# EAGLE board homeboard20 (EAGLE 6.0)
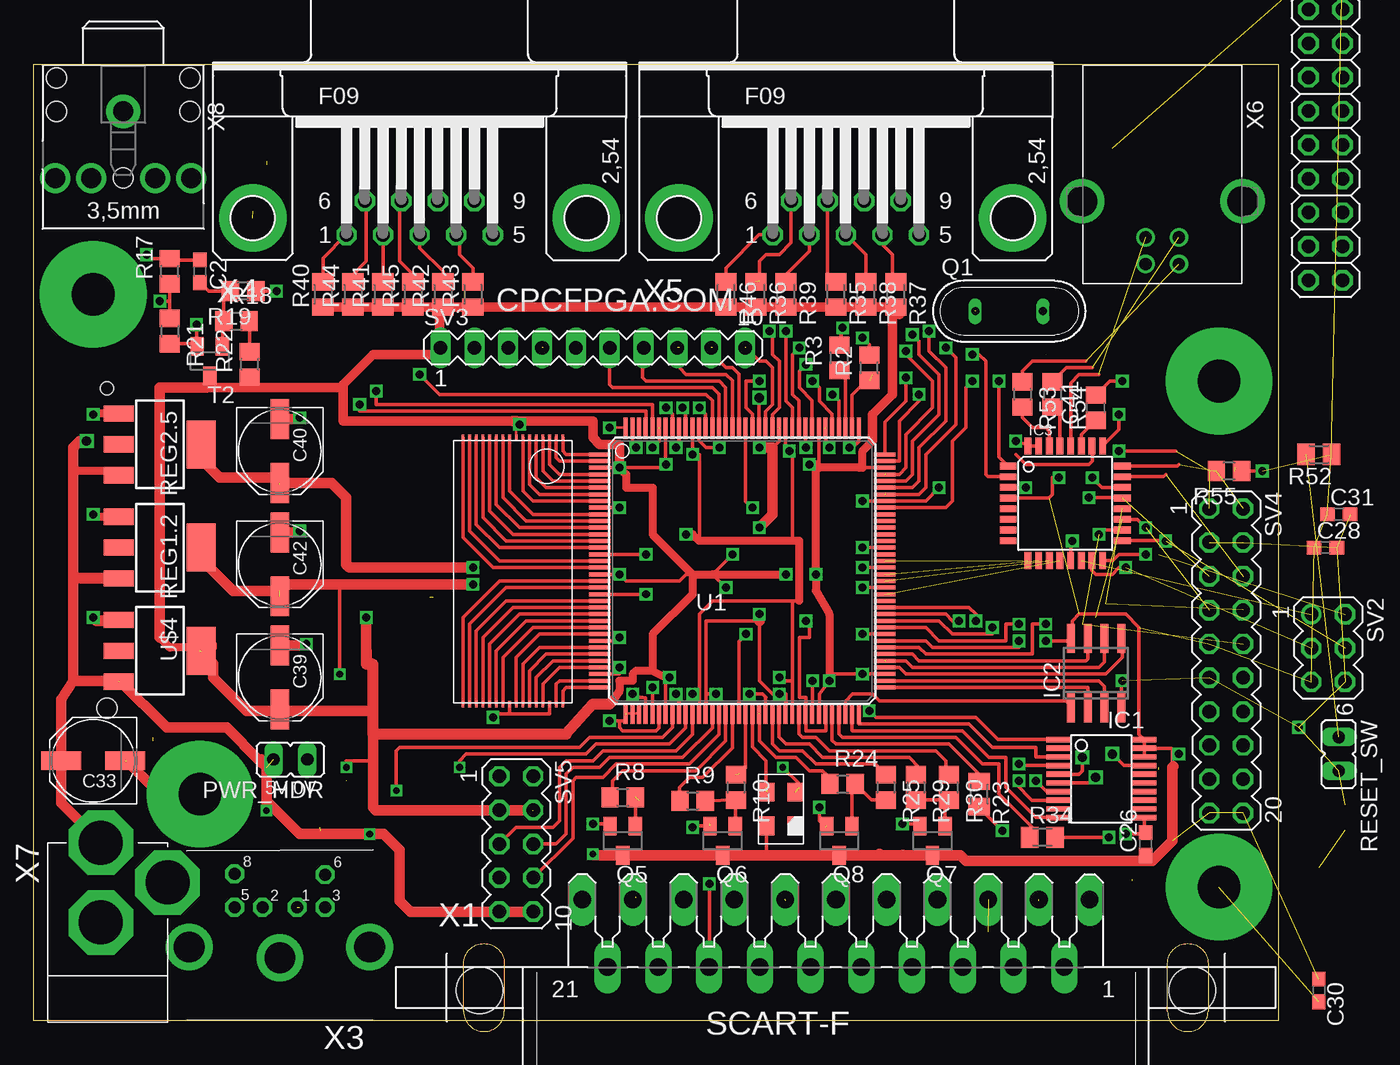
[diagram p3: board, top side]
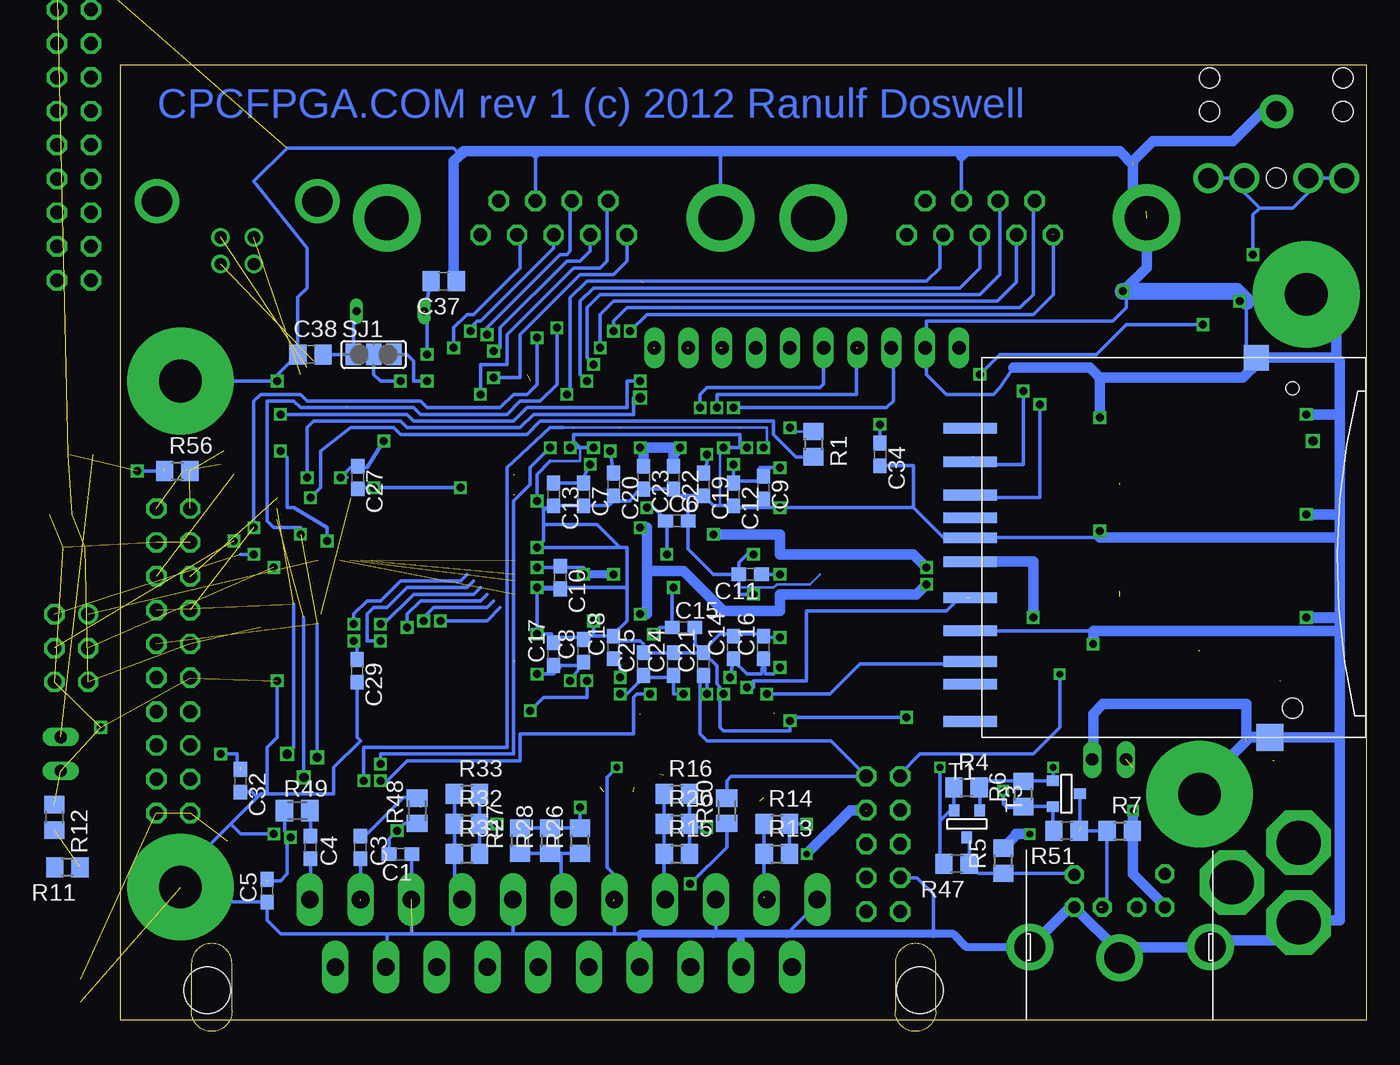
[diagram p4: board, bottom side, seen from below]

Size 93.5 x 71.75 mm. Coordinates in mm from the lower left corner, seen from the top.
Outline: 0,0 93.5,0 93.5,71.75 0,71.75 0,0
Copper layers (1*16): Top 0.0356mm / dielectric 1.5011mm / Bottom 0.0356mm
Design rules: minimum track width 6mil, minimum drill 13mil, track to track 6mil, track to pad 6mil, pad to pad 6mil, via to via 6mil, smd to smd 6mil, copper to edge 15mil, drill to drill 6mil, minimum pad ring 7mil, minimum via ring 7mil, stop-mask expansion 4mil, vias tented up to drill 0mil, thermal gap 10mil
Net classes: 1 power: width 0.6 mm, drill 1.1 mm, clearance 0.4 mm; 2 gnd: width 0.305 mm, drill 0.508 mm, clearance 0.152 mm

## Footprints (pad centres in the part's own frame; a part is rotated, then mirrored left to right if it is on the bottom)
C0603 = smd 1.1 x 1: 1 -0.85,0; 2 0.85,0
PANASONIC_D = smd 3 x 1.4: + 2.4,0; - -2.4,0
C0805 = smd 1.3 x 1.5: 1 -0.95,0; 2 0.95,0
VO20 = smd 0.4 x 1.8: 1 5.85,6.15; 2 5.2,6.15; 3 4.55,6.15; 4 3.9,6.15; 5 3.25,6.15; 6 2.6,6.15; 7 1.95,6.15; 8 1.3,6.15; 9 0.65,6.15; 10 0,6.15; 11 0,-0.3; 12 0.65,-0.3; 13 1.3,-0.3; 14 1.95,-0.3; 15 2.6,-0.3; 16 3.25,-0.3; 17 3.9,-0.3; 18 4.55,-0.3; 19 5.2,-0.3; 20 5.85,-0.3
SO-08 = smd 0.6 x 2.2: 1 -1.905,-2.6; 2 -0.635,-2.6; 3 0.635,-2.6; 4 1.905,-2.6; 5 1.905,2.6; 6 0.635,2.6; 7 -0.635,2.6; 8 -1.905,2.6
TQFP32-08 = smd 1.27 x 0.508: 1 -4.293,2.8; 2 -4.293,2; 3 -4.293,1.2; 4 -4.293,0.4; 5 -4.293,-0.4; 6 -4.293,-1.2; 7 -4.293,-2; 8 -4.293,-2.8; 17 4.293,-2.8; 18 4.293,-2; 19 4.293,-1.2; 20 4.293,-0.4; 21 4.293,0.4; 22 4.293,1.2; 23 4.293,2; 24 4.293,2.8 | smd 0.508 x 1.27: 9 -2.8,-4.293; 10 -2,-4.293; 11 -1.2,-4.293; 12 -0.4,-4.293; 13 0.4,-4.293; 14 1.2,-4.293; 15 2,-4.293; 16 2.8,-4.293; 25 2.8,4.293; 26 2,4.293; 27 1.2,4.293; 28 0.4,4.293; 29 -0.4,4.293; 30 -1.2,4.293; 31 -2,4.293; 32 -2.8,4.293
2X10 = drill 1.016 octagon: 1 -11.43,-1.27; 2 -11.43,1.27; 3 -8.89,-1.27; 4 -8.89,1.27; 5 -6.35,-1.27; 6 -6.35,1.27; 7 -3.81,-1.27; 8 -3.81,1.27; 9 -1.27,-1.27; 10 -1.27,1.27; 11 1.27,-1.27; 12 1.27,1.27; 13 3.81,-1.27; 14 3.81,1.27; 15 6.35,-1.27; 16 6.35,1.27; 17 8.89,-1.27; 18 8.89,1.27; 19 11.43,-1.27; 20 11.43,1.27
JP1 = drill 0.914 long: 1 0,-1.27; 2 0,1.27
QS = drill 0.61 long: 1 -2.54,0; 2 2.54,0
SOT23 = smd 1 x 1.4: 1 -0.95,-1.1; 2 0.95,-1.1; 3 0,1.1
R0805 = smd 1.3 x 1.5: 1 -0.95,0; 2 0.95,0
M0805 = smd 1.3 x 1.6: 1 -0.95,0; 2 0.95,0
SOT223 = smd 1.219 x 2.235: 1 -2.311,-3.099; 2 0,-3.099; 3 2.311,-3.099 | smd 3.6 x 2.2: 4 0,3.099
SJ_2 = smd 1.168 x 1.6: 1 -1.524,0; 2 0,0; 3 1.524,0
MA03-2 = drill 1.016: 1 -2.54,-1.27 | drill 1.016 octagon: 2 -2.54,1.27; 3 0,-1.27; 4 0,1.27; 5 2.54,-1.27; 6 2.54,1.27
MA10-1 = drill 1.016 long: 1 -11.43,0; 2 -8.89,0; 3 -6.35,0; 4 -3.81,0; 5 -1.27,0; 6 1.27,0; 7 3.81,0; 8 6.35,0; 9 8.89,0; 10 11.43,0
MA10-2 = drill 1.016 octagon: 1 -11.43,-1.27; 2 -11.43,1.27; 3 -8.89,-1.27; 4 -8.89,1.27; 5 -6.35,-1.27; 6 -6.35,1.27; 7 -3.81,-1.27; 8 -3.81,1.27; 9 -1.27,-1.27; 10 -1.27,1.27; 11 1.27,-1.27; 12 1.27,1.27; 13 3.81,-1.27; 14 3.81,1.27; 15 6.35,-1.27; 16 6.35,1.27; 17 8.89,-1.27; 18 8.89,1.27; 19 11.43,-1.27; 20 11.43,1.27
MA05-2 = drill 1.016 octagon: 1 -5.08,-1.27; 2 -5.08,1.27; 3 -2.54,-1.27; 4 -2.54,1.27; 5 0,-1.27; 6 0,1.27; 7 2.54,-1.27; 8 2.54,1.27; 9 5.08,-1.27; 10 5.08,1.27
SOT-23 = smd 0.787 x 0.889: 1 0.025,-1.016; 2 -0.94,1.016; 3 0.991,1.016
TQ144 = smd 1.6 x 0.3: P1 -10.7,8.75; P2 -10.7,8.25; P3 -10.7,7.75; P4 -10.7,7.25; P5 -10.7,6.75; P6 -10.7,6.25; P7 -10.7,5.75; P8 -10.7,5.25; P9 -10.7,4.75; P10 -10.7,4.25; P11 -10.7,3.75; P12 -10.7,3.25; P13 -10.7,2.75; P14 -10.7,2.25; P15 -10.7,1.75; P16 -10.7,1.25; P17 -10.7,0.75; P18 -10.7,0.25; P19 -10.7,-0.25; P20 -10.7,-0.75; P21 -10.7,-1.25; P22 -10.7,-1.75; P23 -10.7,-2.25; P24 -10.7,-2.75; P25 -10.7,-3.25; P26 -10.7,-3.75; P27 -10.7,-4.25; P28 -10.7,-4.75; P29 -10.7,-5.25; P30 -10.7,-5.75; P31 -10.7,-6.25; P32 -10.7,-6.75; P33 -10.7,-7.25; P34 -10.7,-7.75; P35 -10.7,-8.25; P36 -10.7,-8.75; P73 10.7,-8.75; P74 10.7,-8.25; P75 10.7,-7.75; P76 10.7,-7.25; P77 10.7,-6.75; P78 10.7,-6.25; P79 10.7,-5.75; P80 10.7,-5.25; P81 10.7,-4.75; P82 10.7,-4.25; P83 10.7,-3.75; P84 10.7,-3.25; P85 10.7,-2.75; P86 10.7,-2.25; P87 10.7,-1.75; P88 10.7,-1.25; P89 10.7,-0.75; P90 10.7,-0.25; P91 10.7,0.25; P92 10.7,0.75; P93 10.7,1.25; P94 10.7,1.75; P95 10.7,2.25; P96 10.7,2.75; P97 10.7,3.25; P98 10.7,3.75; P99 10.7,4.25; P100 10.7,4.75; P101 10.7,5.25; P102 10.7,5.75; P103 10.7,6.25; P104 10.7,6.75; P105 10.7,7.25; P106 10.7,7.75; P107 10.7,8.25; P108 10.7,8.75 | smd 0.3 x 1.6: P37 -8.75,-10.7; P38 -8.25,-10.7; P39 -7.75,-10.7; P40 -7.25,-10.7; P41 -6.75,-10.7; P42 -6.25,-10.7; P43 -5.75,-10.7; P44 -5.25,-10.7; P45 -4.75,-10.7; P46 -4.25,-10.7; P47 -3.75,-10.7; P48 -3.25,-10.7; P49 -2.75,-10.7; P50 -2.25,-10.7; P51 -1.75,-10.7; P52 -1.25,-10.7; P53 -0.75,-10.7; P54 -0.25,-10.7; P55 0.25,-10.7; P56 0.75,-10.7; P57 1.25,-10.7; P58 1.75,-10.7; P59 2.25,-10.7; P60 2.75,-10.7; P61 3.25,-10.7; P62 3.75,-10.7; P63 4.25,-10.7; P64 4.75,-10.7; P65 5.25,-10.7; P66 5.75,-10.7; P67 6.25,-10.7; P68 6.75,-10.7; P69 7.25,-10.7; P70 7.75,-10.7; P71 8.25,-10.7; P72 8.75,-10.7; P109 8.75,10.7; P110 8.25,10.7; P111 7.75,10.7; P112 7.25,10.7; P113 6.75,10.7; P114 6.25,10.7; P115 5.75,10.7; P116 5.25,10.7; P117 4.75,10.7; P118 4.25,10.7; P119 3.75,10.7; P120 3.25,10.7; P121 2.75,10.7; P122 2.25,10.7; P123 1.75,10.7; P124 1.25,10.7; P125 0.75,10.7; P126 0.25,10.7; P127 -0.25,10.7; P128 -0.75,10.7; P129 -1.25,10.7; P130 -1.75,10.7; P131 -2.25,10.7; P132 -2.75,10.7; P133 -3.25,10.7; P134 -3.75,10.7; P135 -4.25,10.7; P136 -4.75,10.7; P137 -5.25,10.7; P138 -5.75,10.7; P139 -6.25,10.7; P140 -6.75,10.7; P141 -7.25,10.7; P142 -7.75,10.7; P143 -8.25,10.7; P144 -8.75,10.7
GNDHOLE = drill 3.2 pad 8: GND 0,0
OSC_7C = smd 1.4 x 1.2: ENA -1.27,-1.1; GND 1.27,-1.1; OUT 1.27,1.1; VDD -1.27,1.1
SDCARD-NOHOLE = smd 0.8 x 4 bottom: 1 7.8,0.99; 2 10.3,0.99; 3 13.5,0.99; 4 15.3,0.99; 5 18,0.99; 6 20.5,0.99; 7 22.8,0.99; 8 24.5,0.99; 9 5.3,0.99; CD 12,0.99; WP 27.3,0.99 | smd 2.032 x 2.032 bottom: MT1 28.5,-21.5 | smd 1.9 x 1.9 bottom: MT3 0,-20.5 | hole 1.5: 26.3,-23.21 | hole 1: 2.3,-23.21
TSOP32 = smd 0.5 x 0.2: P1 -9.75,3.75; P2 -9.75,3.25; P3 -9.75,2.75; P4 -9.75,2.25; P5 -9.75,1.75; P6 -9.75,1.25; P7 -9.75,0.75; P8 -9.75,0.25; P9 -9.75,-0.25; P10 -9.75,-0.75; P11 -9.75,-1.25; P12 -9.75,-1.75; P13 -9.75,-2.25; P14 -9.75,-2.75; P15 -9.75,-3.25; P16 -9.75,-3.75; P17 10.25,-3.75; P18 10.25,-3.25; P19 10.25,-2.75; P20 10.25,-2.25; P21 10.25,-1.75; P22 10.25,-1.25; P23 10.25,-0.75; P24 10.25,-0.25; P25 10.25,0.25; P26 10.25,0.75; P27 10.25,1.25; P28 10.25,1.75; P29 10.25,2.25; P30 10.25,2.75; P31 10.25,3.25; P32 10.25,3.75
SCART-CLIP = drill 1.321 long: 1 19.05,5.08; 2 17.145,0; 3 15.24,5.08; 4 13.335,0; 5 11.43,5.08; 6 9.525,0; 7 7.62,5.08; 8 5.715,0; 9 3.81,5.08; 10 1.905,0; 11 0,5.08; 12 -1.905,0; 13 -3.81,5.08; 14 -5.715,0; 15 -7.62,5.08; 16 -9.525,0; 17 -11.43,5.08; 18 -13.335,0; 19 -15.24,5.08; 20 -17.145,0; 21 -19.05,5.08 | hole 3.5: 26.75,-1.75; -26.75,-1.75
M_DIN6 = drill 0.9 pad 1.422 octagon: 1 -1.3,-3.75; 2 1.3,-3.75; 3 -3.4,-3.75; 5 3.4,-3.75; 6 -3.4,-6.2; 8 3.4,-6.25 | drill 2.3 pad 3.5: SH1 6.8,-0.75; SH2 0,0.05; SH3 -6.75,-0.75
F09HP = drill 1.016 octagon: 1 -5.486,-1.27; 2 -2.743,-1.27; 3 0,-1.27; 4 2.743,-1.27; 5 5.486,-1.27; 6 -4.115,1.27; 7 -1.372,1.27; 8 1.372,1.27; 9 4.115,1.27 | drill 3.302 pad 5.08: G1 -12.522,0; G2 12.522,0
85-32004-10X = drill 0.92 pad 1.27: 1 4.71,-1.25; 2 4.71,1.25; 3 2.71,1.25; 4 2.71,-1.25 | drill 2.3 pad 3: M1 0,6.02; M2 0,-6.02
DC-21MM = drill 3.302 pad 4.826 octagon: 1 -5.08,-3.353; 2 -0.076,-6.35; 3 -0.076,-0.356
20-0137 = drill 1.5 pad 2.54: 1 -5,0 | drill 1.5: 2 0,5.1; 3 0,2.4; 4 0,-2.4; 5 0,-5.1 | hole 1.5: -5,5; -5,-5; 0,0; -7.5,5; -7.5,-5

## Placement (x,y rotation side)
C1  [C0603]  72.5,12.5 180 bottom
C2  100nF  [C0603]  12.5,56.25 270 top
C3  [C0603]  75.5,13 270 bottom
C4  [C0603]  79.25,13 270 bottom
C5  [C0603]  82.5,9.75 90 bottom
C6  100nF  [C0603]  51.75,37.5 0 bottom
C7  100nF  [C0603]  58.75,39.5 270 bottom
C8  100nF  [C0603]  58.75,27.75 90 bottom
C9  100nF  [C0603]  45.25,40 270 bottom
C10  100nF  [C0603]  60.5,33.25 270 bottom
C11  100nF  [C0603]  46.25,33.5 180 bottom
C12  100nF  [C0603]  47.5,39.5 270 bottom
C13  100nF  [C0603]  61,39.5 270 bottom
C14  100nF  [C0603]  47.5,28 90 bottom
C15  100nF  [C0603]  51.25,29.5 0 bottom
C16  100nF  [C0603]  45.25,28 90 bottom
C17  100nF  [C0603]  61,27.5 90 bottom
C18  100nF  [C0603]  56.5,28 90 bottom
C19  100nF  [C0603]  49.75,40.25 270 bottom
C20  100nF  [C0603]  56.5,40.25 270 bottom
C21  100nF  [C0603]  49.75,26.75 90 bottom
C22  100nF  [C0603]  52,40.75 270 bottom
C23  100nF  [C0603]  54.25,40.75 270 bottom
C24  100nF  [C0603]  52,26.75 90 bottom
C25  100nF  [C0603]  54.25,26.75 90 bottom
C26  100nF  [C0603]  83.5,13.25 90 top
C27  100nF  [C0603]  75.7,40.76 270 bottom
C28  100nF  [C0603]  97,35.5 0 top
C29  100nF  [C0603]  75.75,26.25 270 bottom
C30  100nF  [C0603]  96.5,2.25 270 top
C31  100nF  [C0603]  98,38 0 top  (outside the outline)
C32  100nF  [C0603]  84.5,18 270 bottom
C33  100u  [PANASONIC_D]  4.5,19.5 180 top
C34  100nF  [C0603]  36.5,42.5 270 bottom
C37  [C0805]  69.25,55.5 180 bottom
C38  [C0805]  79.25,50 0 bottom
C39  100u  [PANASONIC_D]  18.5,25.75 270 top
C40  100u  [PANASONIC_D]  18.5,42.75 270 top
C41  1uF  [C0805]  79.75,46 90 top
C42  100u  [PANASONIC_D]  18.5,34.25 270 top
IC1  XCF02S  [VO20]  83.09,15.24 90 top
IC2  25LC080SN  [SO-08]  79.78,26.08 0 top
IC3  ATMEGA32U2-TQFP  [TQFP32-08]  77.47,38.82 0 top
JP1  [2X10]  97,67 270 top
PWR_HDR  [JP1]  19.3,19.59 90 top
Q1  [QS]  73.25,53.25 0 top
Q5  BC848SMD  [SOT23]  44.25,13.5 180 top
Q6  BC848SMD  [SOT23]  51.75,13.5 180 top
Q7  BC848SMD  [SOT23]  67.5,13.5 180 top
Q8  BC848SMD  [SOT23]  60.5,13.5 180 top
R1  100  [R0805]  41.5,43.26 270 bottom
R2  100  [R0805]  62.75,49 90 top
R3  100  [R0805]  60.5,49.75 90 top
R4  1000  [R0805]  30,17.5 0 bottom
R5  1000  [R0805]  27.25,12 90 bottom
R6  1000  [R0805]  25.75,17 90 bottom
R7  1000  [R0805]  18.5,14.25 0 bottom
R8  2200  [R0805]  44.25,16.75 0 top
R9  2200  [R0805]  49.5,16.5 0 top
R10  1000  [R0805]  52.75,17.5 270 top
R11  75  [R0805]  97.5,11.5 180 bottom  (outside the outline)
R12  750  [R0805]  98.5,15.25 270 bottom  (outside the outline)
R13  680  [R0805]  44.25,12.5 0 bottom
R14  2200  [R0805]  44.25,14.75 0 bottom
R15  270  [R0805]  51.75,12.5 0 bottom
R16  680  [R0805]  51.75,17 0 bottom
R17  10000  [R0805]  10.25,56.25 90 top
R18  4700  [R0805]  15.25,52.5 0 top
R19  10000  [R0805]  15.75,54.75 180 top
R20  4700  [R0805]  51.75,14.75 0 bottom
R21  47000  [R0805]  10.25,51.75 270 top
R22  1000  [R0805]  16.25,49.25 90 top
R23  [M0805]  71,17 270 top
R24  2200  [R0805]  60.75,17.75 0 top
R25  1000  [R0805]  64,17.5 270 top
R26  270  [R0805]  59,13.5 90 bottom
R27  680  [R0805]  63.5,13.5 90 bottom
R28  4700  [R0805]  61.25,13.5 90 bottom
R29  2200  [R0805]  66.25,17.5 270 top
R30  1000  [R0805]  68.75,17.5 270 top
R31  270  [R0805]  67.5,12.5 0 bottom
R32  680  [R0805]  67.5,14.75 0 bottom
R33  4700  [R0805]  67.5,17 0 bottom
R34  [M0805]  75.75,13.75 0 top
R35  [M0805]  60.25,54.5 270 top
R36  [M0805]  54.25,54.5 270 top
R37  [M0805]  64.75,54.5 270 top
R38  [M0805]  62.5,54.5 270 top
R39  [M0805]  56.5,54.5 270 top
R40  [M0805]  21.75,54.5 90 top
R41  [M0805]  26.25,54.5 90 top
R42  [M0805]  30.75,54.5 90 top
R43  [M0805]  33,54.5 90 top
R44  [M0805]  24,54.5 90 top
R45  [M0805]  28.5,54.5 90 top
R46  [M0805]  52,54.5 270 top
R47  270  [R0805]  30.75,11.75 180 bottom
R48  [M0805]  71.25,15.75 90 bottom
R49  [M0805]  80.25,15.75 0 bottom
R50  2k2  [M0805]  48,15.75 90 bottom
R51  270  [R0805]  22.5,14.25 180 bottom
R52  4K7  [M0805]  96.5,42.5 180 top
R53  22  [R0805]  74.25,47 270 top
R54  22  [R0805]  76.5,47 270 top
R55  4700  [R0805]  89.75,41.25 180 top
R56  4700  [R0805]  89.25,41.25 0 bottom
REG1.2  1.2V  [SOT223]  9.5,35.5 270 top
REG2.5  2.5V  [SOT223]  9.5,43.25 270 top
RESET_SW  [JP1]  98,20 180 top  (outside the outline)
SJ1  [SJ_2]  74.5,50 0 bottom
SV2  [MA03-2]  97.21,27.96 270 top
SV3  [MA10-1]  42,50.5 0 top
SV4  [MA10-2]  89.55,27 270 top
SV5  [MA05-2]  36.25,13.25 270 top
T1  BSS138  [SOT-23]  30,14.75 0 bottom
T2  BC848  [SOT23]  13.25,49.5 180 top
T3  BSS138  [SOT-23]  22.5,17 90 bottom
U1  XC3S400TQ144  [TQ144]  53.22,33.75 0 top
U$1  GNDHOLE  [GNDHOLE]  12.5,17 0 top
U$2  TXO_7C  [OSC_7C]  56.12,15.88 90 top
U$3  SDMMCNOHOLE  [SDCARD-NOHOLE]  28.75,49.75 270 top
U$4  3.3V  [SOT223]  9.5,27.75 270 top
U$6  AS6C4008  [TSOP32]  36,34 270 top
U$7  GNDHOLE  [GNDHOLE]  4.5,54.5 0 top
U$8  GNDHOLE  [GNDHOLE]  89,48 0 top
U$9  GNDHOLE  [GNDHOLE]  89,10 0 top
X1  SCART-CLIP  [SCART-CLIP]  60.25,4 0 top
X3  [M_DIN6]  18.5,4.75 180 top
X4  [F09HP]  29,60.25 0 top
X5  [F09HP]  61,60.25 0 top
X6  MINI-USB_4P-85-32004-10X  [85-32004-10X]  84.75,61.5 270 top
X7  DC21MMX  [DC-21MM]  5,7 180 top
X8  STEREOJACK  [20-0137]  6.75,63.25 270 top

## Tracks (layer width: path | path; a pad name or v marks a point on that pad's centre or on a via)
AT_CLKO  (via drill 0.6, 0.7)
  Top 0.254: U1.P124 54.47,46.47 v54.5,46.75 | IC3.22 80.23,40.02 v79.5,40.75
  Bottom 0.254: v54.5,46.75 55,46.75 55,45.5 62.5,45.5 63.5,44.5 72,44.5 72.5,45 79,45 79.5,44.5 v79.5,40.75
AT_RESET  (2 unrouted)
  Top 0.254: IC3.24 85.87,41.62 86,41.75
B0
  Top 0.254: U1.P63 57.47,21.53 57.75,21.25 58.75,21.25 59.75,20.25 67.75,20.25 68.5,19.5 68.5,18.7 R30.1
B1
  Top 0.254: U1.P60 55.97,21.28 56.5,20.75 58.25,20.75 59.25,19.75 65.75,19.75 66.5,19 66.5,18.7 R29.1
CASIN  (via drill 0.6)
  Top 0.254: R21.2 12.1,50.8 T2.2 12.3,50.8 12.5,51 12.25,51 v12.25,52.25 | U1.P131 50.97,46.53 50.5,47 30.5,47 v29,48.5
  Bottom 0.254: v12.25,52.25 18,52.25 20.25,50 27.5,50 v29,48.5
CLK16  (1 unrouted)
  Top 0.254: U1.P56 53.97,20.53 55,19.5 55,17.5
CLK_5V
  Bottom 0.254: T1.1 29.8,13.56 R47.1 29.1,11.05 R5.1 22,11.05 X3.6
CSYNC
  Top 0.254: U1.P52 51.97,20.97 49.75,18.75 44.25,18.75 43.5,18 43.5,16.95 R8.1
D_FASTBLANKING  (1 unrouted)
DATA_5V  (2 unrouted)
  Bottom 0.254: 20,8.5 19.45,9.05 R7.1 21.25,14.25 21.5,14.5 21.48,14.52 T3.1
EMER_BOOT  (via drill 0.6)  (2 unrouted)
  Top 0.254: IC3.13 77.87,35.87 v78,36 | v81.5,42.75 85.75,42.75
  Bottom 0.254: v78,36 78,37 80.5,38.5 81,38.5 81,42.25 v81.5,42.75
EXP_A
  Top 0.254: U1.P47 49.47,21.47 48.25,20.25 42.75,20.25 42,19.5 40,19.5 39.5,19 39.5,15 39,14.5 36.23,14.5 SV5.5
EXP_B
  Top 0.254: U1.P50 50.97,21.97 48.75,19.75 43.25,19.75 42.5,19 40.5,19 40,18.5 40,14 39.25,13.25 SV5.6
EXP_C
  Top 0.254: U1.P51 51.47,21.47 49.25,19.25 43.75,19.25 42.75,18.25 40.75,18.25 40.5,18 40.5,13.69 SV5.8
EXTCLK  (via drill 0.6)
  Top 0.254: U1.P100 68.5,38.5 69,39 69,43.5 70,44.5 70,47.5 v70.5,48
  Bottom 0.254: v70.5,48 71.5,48 71.5,49.5 72,50 SJ1.3
FL_DI
  Top 0.254: U1.P76 65,26.5 65.5,26 80.5,26 81.75,27.25 81.75,28.62 IC2.5
FL_DO
  Top 0.254: IC2.2 79.14,25 U1.P73
FL_HOLD
  Top 0.254: IC2.7 79.14,27.14 79,27 66.5,27 66,27.5 U1.P78
FL_SCLK  (1 unrouted)
  Top 0.254: IC2.6 80.42,26.91 80,26.5 66,26.5 65.5,27 64,27
FL_SEL
  Top 0.254: U1.P70 60.97,23.97 61.5,24.5 63,24.5 63.5,24 77.5,24 78,23.5 | 78,24.5 78,23.5 | 78,23.5 78,23 77.98,22.98 IC2.1 77.98,23.48 78,23.5
FL_WP
  Top 0.254: IC2.3 80.42,25.09 80,25.5 U1.P74
FPGA_AUDIO_LEFT
  Top 0.254: U1.P68 59.97,21.03 60.25,20.75 68.75,20.75 71,18.5 R23.1
FPGA_AUDIO_RIGHT
  Top 0.254: U1.P69 60.47,21.53 60.75,21.25 69.25,21.25 71.25,19.25 72.5,19.25 72.5,17 75.25,14.25 75.25,13.95 R34.1
G0
  Top 0.254: U1.P59 55.47,20.78 56,20.25 57.75,20.25 58.75,19.25 63.2,19.25 R25.1
G1  (1 unrouted)
  Top 0.254: R24.1 59.5,18.05 59.5,18.5 59.25,18.75 58.25,18.75 57.25,19.75 55.75,19.75 54.5,21 54.5,23
GND  (via drill 0.5, 0.6)  (21 unrouted)
  Top 0.2: U1.P37 U1.P38 U1.P39
  Top 0.254: U1.P9 v44,38.5 | U1.P22 v46,32 | U1.P16 v46,35 | v46.5,43 47,43.5 47,44.5 | U1.P136 48.47,43.53 v48.25,43 | U1.P81 v62.25,29 | U1.P88 v62.25,32.5 | U1.P94 v62.25,35.5 | v58,30 58.25,29.75 58.25,28.75 57.5,28.75 57.5,24.25 58,24.25 58,23.08 | U1.P117 57.97,43.03 v58,43 | v59.75,43 59.5,43 59.5,44.5 | U$6.P30 38.75,23 35.75,23 | 44.5,23 44.5,22.5 44,22.5 | U$6.P24 35.75,23 | 35.75,23 34.5,23 v34.5,22.75 | 44,22.5 v43.25,22.5 | U1.P45 48.47,24.28 v48.25,24.5 | U1.P29 43.75,28.5 v44,28.75 | U1.P42 46.97,21.97 46.75,21.75 44.25,21.75 44,22 44,22.5 | U1.P67 59.5,23.05 59.5,21.75 58,21.75 58,23.08 | U$2.GND 57,17.14 | 58,23.08 U1.P64 | R17.1 10.25,55.25 | R21.1 10.25,54 | 10.25,54 10.25,55.25 | 10.25,55.25 10,55.5 | R19.1 v18.25,54.75 | v9.5,54 10.25,54 | 57.5,17.5 57.5,17.75 v56.25,19 | C26.2 83.39,14.21 IC1.11 83.39,14.39 83,14 v82,14 | IC2.4 81.69,25.43 v81.75,25.5 | v74.5,40 74.48,40.02 IC3.3 73.15,40 | v81.75,48 80.8,48 C41.2 | v62.25,39 U1.P101 67,39 v68,40
  Top 0.6: 6,30 6.4,30 U$4.1
  Top 0.61: REG2.5.1 4.56,45.56 v4.5,45.5 | REG1.2.1 4.69,37.81 v4.5,38
  Top 0.8: C39.- 20.5,28.15 v20.5,28.25 | C42.- 20,36.65 v20,36.75 | C40.- 20,45.15 v20,45.25 | U$1.GND 9.5,17 7,19.5
  Top 0.813: 6,30 4.75,30 v4.5,30.25
  Bottom 0.2: 25.5,5.5 X3.SH3 | 22.25,8.5 X3.3 | 18.5,5.1 X3.SH2 | 41,33.5 41.75,32.75 44.25,32.75 44.5,32.5 47.1,32.5 | 48.5,42.75 48.5,38.75 | 61.25,42 59,42 59,43
  Bottom 0.254: 45.5,38.5 v44,38.5 34,38.5 | C9.2 45.5,38.5 | v62.25,32.5 62.15,32.4 C10.2 | 61.75,38.25 61.75,38.5 v62.25,39 62.25,41 61.25,42 | 58.5,28.75 60.75,28.75 C17.2 61.15,29 v62.25,29 v62.25,32.5 | 58.5,28.75 C8.2 58.4,28.5 | 47.65,29 45.5,29 C16.2 45.15,28.75 v44,28.75 | C21.2 C24.2 C25.2 54.25,28.25 54.5,28.5 56.15,28.5 C18.2 58,28.85 | C15.2 50.4,28.25 C21.2 | C21.2 49.75,27.75 48.5,29 47.65,29 | 47.65,29 C14.2 | 48.5,42.75 v48.25,43 47,43 | 47,43 v46.5,43 | 56.5,39 55.25,39 54.6,39.9 C23.2 C22.2 51.5,39.4 51,39.4 | 56.5,39 56.65,39 C20.2 | 51,39.4 C19.2 49,38.65 C12.2 47.35,38.5 45.5,38.5 | v58,43 59,43 | 59,43 v59.75,43 | 56.5,39 56.85,38.65 C7.2 C13.2 61.35,38.65 61.75,38.25 | 51,39.4 50.9,39.3 C6.2 50.9,35.4 49,33.5 C11.2 | 34,38.5 34,41.65 C34.2 | 47,43 47,44 59.5,44 59.5,43.5 59,43 | 55.5,32.5 v62.25,32.5 | v46,35 46.5,35 47.1,34.4 C11.2 | C11.2 47.1,32.5 47.1,32.1 47,32 v46,32 | X1.21 41.2,8.8 43.5,6.5 | 56.5,6.5 54.5,6.5 54.53,6.46 X1.14 | 56.5,6.5 64,6.5 | 64,6.5 71.5,6.5 | 71.5,6.5 73.5,6.5 | 73.5,6.5 73.5,4.08 X1.4 | X1.9 64.06,6.56 64,6.5 | X1.13 56.44,6.56 56.5,6.5 | X1.17 48.82,6.68 49,6.5 | 46.91,6.42 47,6.5 | 73.5,6.5 81.5,6.5 82.5,7.5 C5.1 87.9,8.9 U$9.GND 89,11 85.25,14.75 | 56,35.5 v62.25,35.5 61.75,36 61.75,37.25 | 56,35.5 55.5,35.5 55.5,32.5 | v34.5,22.75 43,22.75 v43.25,22.5 43.25,21.75 48.25,21.75 48.5,22 48.5,24.75 | U$3.6 20.5,29.25 | 20,36.25 U$3.3 31.75,36.25 34,38.5 | v48.25,24.5 48.5,24.75 | 48.5,24.75 48.5,25 48.75,25.25 48.75,26.6 C21.2 | 58,28.85 58.5,28.85 58.5,28.75 | v58,30 58,28.85 | 56.5,9 56.5,11 57,11.5 57,18.25 v56.25,19 | v9.5,54 9,54 9,50.5 U$3.MT3 | 61.75,37.25 61.75,38.25 | 61.75,37.25 57.75,37.25 56,35.5
  Bottom 0.254: 55.5,32.5 55.5,30 56.5,29 | C1.1 71.65,6.65 71.5,6.5 | SV5.7 33.71,10.71 32.5,9.5 32.5,6.5 | 68,65 68.5,65.5 81,65.5 83.5,63 79.5,58 79.5,55 80.2,54.3 C38.1 82.2,48 | 82.5,17 77.5,17 77.5,19 75.5,21 75.75,21.25 C29.2 | 82.5,17 83,17 83.25,16.75 | 83.25,16.75 85.25,14.75 | v82,14 84.5,14 85.25,14.75 | C32.2 83.65,17.15 83.25,16.75 | v81.75,25.5 81.75,21.25 82.5,20.5 82.5,17 | 26.5,49 27.5,47.5 28,47 31.5,47 33,48.5 33,50.61 | 33,50.61 SV3.2 | 33,50.61 33,52.5 19,52.5 18,53.5 18,54.5 v18.25,54.75 | X5.G1 48.48,65.23 | X4.8 30.37,64.62 31,65.25 | X5.8 62.37,65.12 | C27.2 75.86,40 75.5,40 v74.5,40 v68,40 | U$8.GND 82.2,48 | 82.2,48 v81.75,48
  Bottom 0.6: 4.93,7.5 X7.3 | 54.5,6.5 49,6.5 47,6.5 43.5,6.5 32.5,6.5 31,6.5 30,5.5 25.5,5.5 | X1.18 46.91,6.42
  Bottom 0.61: 2,36 2,36.25
  Bottom 0.8: 2,30 2,36 2,38 | X3.SH3 22.25,8.5 | X3.3 18.5,5.1 | X3.SH2 17.7,5.5 X3.SH1 11.2,6 6.43,6 X7.3 | 30.37,64.88 30,65.25 | 30,65.25 18.5,65.25 17.5,64.25 17.5,61.75 16.5,60.75 | 2,29.25 20.5,29.25 v20.5,28.25 | 2,36.25 20,36.25 v20,36.75 | v20,45.25 20,48.25 | 7.5,21.5 7.5,21.25 9,21.25 9,23.75 19.75,23.75 20.5,23 20.5,19.66 PWR_HDR.1 | U$1.GND 12.5,17.5 9,21 | 2,45.5 2,49.5 2.25,49.75 | 2,45.5 2,38 | v4.5,45.5 2,45.5 | v4.5,38 2,38 | 2.5,30.25 2.25,30.25 2,30 | 2,30 2,29.25 | U$3.MT1 2,21.25 | 2,21.25 2,29.25 | 4.93,7.5 2,7.5 2,21.25 | U$3.MT3 2.25,49.75 | 2.25,49.75 2.25,51.75 U$7.GND | 20,48.25 9.25,48.25 8,49.5 | 26.5,49 20.75,49 20,48.25 | X4.G1 16.48,56.52 v18.25,54.75 | X8.1 7.75,68.25 10,66 16,66 17.5,64.5 | 30,65.25 31,65.25 48.5,65.25 | 48.5,65.25 62.5,65.25 | 62.5,65.25 67.75,65.25 68,65 68.5,64.5 68.5,56 C37.1 | 62.37,65.12 62.5,65.25 | 48.48,65.23 48.5,65.25
  Bottom 0.813: U$3.MT1 9,21.25 | v4.5,30.25 2.5,30.25
  Bottom 1.27: v18.25,54.75 9.75,54.75 9,54
  other vias: 95,22
JOY0_DOWN  (via drill 0.6)
  Top 0.254: U1.P118 57.47,46.53 57,47 57,50 v57.5,50.5 | R41.2 X4.2
  Bottom 0.254: v57.5,50.5 57.5,53 56.5,54 27.7,54 R41.2 X4.2
JOY0_FIRE1  (via drill 0.6)
  Top 0.254: U1.P116 58.47,46.53 57.5,47.5 57.5,48.75 v58,49.25 | R45.2 28.5,56 27.5,57 27.5,61.39 X4.7
  Bottom 0.254: v58,49.25 58.5,49.75 58.5,53.5 57.5,54.5 29,54.5 27.5,56 27.5,61.39 X4.7
JOY0_FIRE2  (via drill 0.6)
  Top 0.254: U1.P119 56.97,46.03 56.5,46.5 v56.5,51.75 | R44.2 24,56 25,57 25,61.41 X4.6
  Bottom 0.254: v56.5,51.75 56.5,52.5 55.5,53.5 26,53.5 25,54.5 25,61.41 X4.6
JOY0_LEFT  (via drill 0.6)
  Top 0.254: U1.P113 59.97,45.53 59,46.5 59,47.5 v58.5,48 | R42.2 30.75,56.25 29,58 X4.3
  Bottom 0.254: v58.5,48 59,48.5 59,54 58,55 30.5,55 29,56.5 X4.3
JOY0_RIGHT  (via drill 0.6)
  Top 0.254: U1.P112 60.47,46.53 v60,47 | R43.2 33,56.5 32,57.5 32,58.72 X4.4
  Bottom 0.254: v60,47 59.75,47 59.75,54.25 58.5,55.5 33,55.5 32,56.5 32,58.72 X4.4
JOY0_UP  (via drill 0.6)  (1 unrouted)
  Top 0.254: U1.P122 55.47,45.47 56,46 56,49.5 55.5,50 55.5,51.5 v55.25,51.75 | R40.2 21.75,57.25 23.5,59
  Bottom 0.254: v55.25,51.75 54,53 25,53 23.5,54.5 23.5,58.97 X4.1
JOY1_DOWN  (via drill 0.6)  (1 unrouted)
  Top 0.254: X5.2 58.26,57.76 56.5,56 R39.1 | v65.5,50.25 65.5,50 67.5,48 67.5,46 65.5,44 65.5,41.5 65,41 64,41
  Bottom 0.254: X5.2 58.26,57.76 59.01,57 60,57 65,52 65,50.5 65.25,50.25 v65.5,50.25
JOY1_FIRE1  (via drill 0.6)
  Top 0.254: X5.7 59.63,56.07 R35.1 | v66,51.5 66.5,51 66.5,50 68,48.5 68,45.5 66,43.5 66,41 65.5,40.5 U1.P104
  Bottom 0.254: v66,51.5 66,52 60.5,57.5 60,57.5 59.75,57.75 59.75,61.4 X5.7
JOY1_FIRE2  (via drill 0.6)  (1 unrouted)
  Top 0.254: X5.6 56.88,58.38 56,57.5 55,57.5 54.5,57 54.5,55.5 | v66.5,47 66.5,46.5 65,45 65,42 U1.P107
  Bottom 0.254: X5.6 57,61.41 57,57 57.5,56.5 59.5,56.5 64.5,51.5 64.5,49.25 66.5,49.25 v66.5,47
JOY1_LEFT  (via drill 0.6)
  Top 0.254: X5.3 61.02,58.98 62.5,57.5 R38.1 | U1.P103 66,40 66.5,40.5 66.5,43 68.5,45 68.5,49 67.25,50.25 v67.25,51.75
  Bottom 0.254: 61,59 X5.3 61,58 66.5,52.5 66.75,52.5 67.25,52 v67.25,51.75
JOY1_RIGHT  (via drill 0.6)  (1 unrouted)
  Top 0.254: X5.4 63.74,58.26 64.5,57.5 64.5,55.7 R37.1 | 68.75,50.25 v68.5,50.5 69.25,49.75 69.25,44.75 67,42.5 67,40 66.5,39.5 64,39.5
  Bottom 0.254: X5.4 63.5,58.74 63.5,56.5 67,53 67.5,53 68.5,52 v68.5,50.5
JOY1_UP  (via drill 0.6)
  Top 0.254: R46.1 52,56.5 54.48,58.98 X5.1 55.5,59 | v65.5,48.25 65.5,46.5 63.92,44.92 U1.P108
  Bottom 0.254: X5.1 55.5,58.97 55.5,57 56.5,56 59,56 63.5,51.5 63.5,48.25 v65.5,48.25
N$1  (via drill 0.6)  (1 unrouted)
  Top 0.254: U1.P135 48.97,45.97 v48.75,46
  Bottom 0.254: v48.75,46 48.75,47 38.25,47 38.25,50.5
N$2  (via drill 0.6)
  Top 0.254: U1.P132 50.47,45.53 v50,46
  Bottom 0.254: v50,46 50,47 49.5,47.5 41,47.5 40.73,47.77 SV3.5
N$3  (via drill 0.6)
  Top 0.254: U1.P137 47.97,45.53 v47.5,46
  Bottom 0.254: v47.5,46 36,46 35.5,46.5 35.5,49.6 SV3.3
N$4
  Top 0.254: U1.P130 51.47,47.03 51,47.5 43.5,47.5 43.25,47.75 43.25,49.98 SV3.6
N$5
  Top 0.254: U1.P129 51.97,47.53 51.5,48 46,48 45.75,48.25 45.75,49.94 SV3.7
N$6  (1 unrouted)
  Top 0.254: U1.P128 52.47,48.03 52,48.5 49,48.5 48.5,49 48.5,50.5
N$7  (1 unrouted)
  Top 0.254: U1.P127 52.97,48.53 52.5,49 52,49 50.5,50.5 51,50.5
N$8  (via drill 0.6)
  Top 0.254: v72.5,48 72.5,42.3 IC3.1
  Bottom 0.254: SJ1.2 74.5,48.5 74,48 v72.5,48
N$9
  Top 0.254: IC3.27 78.67,43.97 C41.1
N$12  (via drill 0.6)  (1 unrouted)
  Top 0.254: IC3.2 71.68,40.82 71.5,41 71.5,49.5 71,50 v70.5,50
  Bottom 0.254: C37.2 Q1.1 | v70.5,50 70.5,53 70.75,53.25
N$14  (1 unrouted)
  Bottom 0.254: SJ1.1 76.02,53.02 Q1.2 | C38.2 76,50
N$16  (1 unrouted)
  Top 0.254: U1.P123 54.97,45.72 55.5,46.25 55.5,49 55,49.5 54.5,49.5 53.5,50.5
N$35  (1 unrouted)
  Top 0.254: 62.77,22.25 70.25,22.25 72,20.5 75.25,20.5 75.25,19.79 IC1.3 | U1.P72 61.97,22.28 62,22.25 62.75,22.25
N$36  (1 unrouted)
  Top 0.254: 79,49.5 75,49.5 74.25,48.75 R53.1
N$38
  Top 0.254: U1.P71 61.47,21.78 61.5,21.75 69.75,21.75 71.75,19.75 73,19.75 73,17.5 75.26,15.24 IC1.10
N$39  (1 unrouted)
  Top 0.254: U1.P110 61.47,46.97 63,48.5
N$40  (via drill 0.6)
  Top 0.2: U1.P143 44.97,43.28 v45.25,43
  Top 0.254: IC1.7 76.06,17.19 v75.25,18
  Bottom 0.2: v45.25,43 45,43.25 45,44.5 60.25,44.5
  Bottom 0.254: v75.25,18 75.25,20.5 64.5,20.5 64.5,41.5 61.25,44.5 60.25,44.5
N$42  (via drill 0.6)
  Top 0.2: v43.25,44.5 44.42,44.5 U1.P144
  Bottom 0.2: R1.1 42.96,44.21 v43.25,44.5
N$43
  Top 0.254: U1.P111 60.97,48.58 R3.1
N$49  (1 unrouted)
  Top 0.254: IC3.29 77.07,45.43 76.5,46
N$50
  Top 0.254: REG2.5.2 6.65,43.5
N$51  (via drill 0.6)  (1 unrouted)
  Top 0.254: v72.75,14.25 71,16
  Bottom 0.254: C1.2 73.35,13.65 v72.75,14.25 72.2,14.8 R48.1
N$52
  Bottom 0.254: C3.1 75.15,13.85 72.25,16.75 71.3,16.75 R48.2
N$53
  Top 0.254: R9.2 R10.2 52.7,15.75 Q6.1
N$54  (via drill 0.6)  (1 unrouted)
  Top 0.254: Q6.2 49.4,14.6 v49.5,14.5
  Bottom 0.254: R15.2 R20.2 R16.2 | v49.5,14.5 50.5,14.5
N$55
  Top 0.254: Q8.1 61.45,17.5 R24.2 62.9,16.55 R25.2
N$56  (via drill 0.6)  (1 unrouted)
  Top 0.254: v59,16 59,15 59.5,14.5
  Bottom 0.254: R27.2 R28.2 R26.2 v59,16
N$57
  Top 0.254: Q7.1 68.45,16.25 R30.2 R29.2
N$58  (via drill 0.6)
  Top 0.254: v65.25,14.75 66.4,14.75 Q7.2
  Bottom 0.254: R31.2 R32.2 | R32.2 R33.2 | R32.2 v65.25,14.75
N$59  (via drill 0.6)
  Top 0.254: v42,14.75 43.15,14.75 Q5.2
  Bottom 0.254: R13.2 R14.2 v42,14.75
N$60
  Top 0.254: C2.2 13.15,54.75 R19.2 14.3,54.25 R18.1 14.2,52.4 T2.1
N$61  (via drill 0.6)
  Top 0.254: C2.1 9.85,57.1 R17.2 8.8,57.2 v8.5,57.5
  Bottom 0.254: 12,63.1 X8.2 X8.3 9.15,62.15 8,61 | X8.5 X8.4 4.35,62.15 5.5,61 8,61 | v8.5,57.5 8.5,60.5 8,61
N$62
  Top 0.254: R22.2 16.25,52.25 | 16.25,52.25 16.5,52.5 | R18.2 16.2,52.3 16.25,52.25
N$63  (1 unrouted)
  Top 0.254: Q5.1 45.2,16.2 45.5,16.5
N$64
  Bottom 0.254: C4.1 79.25,15.75 R49.2
N$65  (via drill 0.6)  (1 unrouted)
  Top 0.254: R34.2 v80.75,13.75
  Bottom 0.254: 82.5,10.5 81.5,10.5 81,11 81,13.75 v80.75,13.75 81.2,14.2 R49.1
N$66  (1 unrouted)
  Top 0.254: 79.5,49 77.55,49 R54.1
N$67
  Top 0.254: U$6.P1 39.75,42.75 40,42.5 U1.P1
N$68
  Top 0.254: IC3.30 76.27,44.23 76,44.5 75,44.5 74.25,45.25 R53.2
N$69  (1 unrouted)
  Top 0.254: IC3.28 77.87,47.87 78.5,48.5 80,48.5
N$71
  Top 0.254: U$6.P2 39.25,42.25 39.5,42 U1.P2
N$72
  Top 0.254: U$6.P3 38.75,41.75 39.5,41 U1.P4
N$73
  Top 0.254: U$6.P4 38.25,41.25 39,40.5 U1.P5
N$74
  Top 0.254: U$6.P5 37.75,40.75 38.5,40 U1.P6
N$75
  Top 0.254: U$6.P6 37.25,40.25 38,39.5 U1.P7
N$76
  Top 0.254: U$6.P7 36.75,39.75 37.5,39 U1.P8
N$77
  Top 0.254: U$6.P9 35.75,39.75 37.5,38 U1.P10
N$78
  Top 0.254: U$6.P10 35.25,39.25 37,37.5 U1.P11
N$79
  Top 0.254: U$6.P11 34.75,38.75 36.5,37 U1.P12
N$80
  Top 0.254: U$6.P12 34.25,38.25 36,36.5 U1.P13
N$81
  Top 0.254: U$6.P13 33.75,37.75 35.5,36 U1.P14
N$82
  Top 0.254: U$6.P14 33.25,37.25 35,35.5 U1.P15
N$83
  Top 0.254: U$6.P15 32.75,36.75 35,34.5 U1.P17
N$84
  Top 0.254: U$6.P16 32.25,36.25 34.5,34 U1.P18
N$85
  Top 0.254: U$6.P17 32.25,30.25 35,33 U1.P20
N$86
  Top 0.254: U$6.P18 32.75,29.75 35.5,32.5 U1.P21
N$87
  Top 0.254: U$6.P19 33.25,29.25 35.5,31.5 U1.P23
N$88
  Top 0.254: U$6.P20 33.75,28.75 36,31 U1.P24
N$89
  Top 0.254: U$6.P21 34.25,28.25 36.5,30.5 U1.P25
N$90
  Top 0.254: U$6.P22 34.75,27.75 37,30 U1.P26
N$91
  Top 0.254: U$6.P23 35.25,27.25 37.5,29.5 U1.P27
N$92
  Top 0.254: U$6.P25 36.25,27.25 38,29 U1.P28
N$93
  Top 0.254: U$6.P26 36.75,26.75 38,28 U1.P30
N$94
  Top 0.254: U$6.P27 37.25,26.25 38.5,27.5 U1.P31
N$95
  Top 0.254: U$6.P28 37.75,25.75 39,27 U1.P32
N$96  (1 unrouted)
  Top 0.254: U$6.P29 38.25,25.25 39.5,26.5 42.5,26.5
N$97
  Top 0.254: U$6.P31 39.25,25.25 39.5,25.5 U1.P35
N$98
  Top 0.254: U$6.P32 39.75,24.75 40,25 U1.P36
PC4
  Top 0.254: 73.75,42.5 74.5,41.75 79.25,41.75 79.5,42 79.5,43.09 IC3.26
PC5  (via drill 0.6)
  Top 0.254: U1.P125 53.97,45.53 53.5,46 53.5,48 v54.5,48 | v81.5,45.5 81.5,44.35 IC3.25
  Bottom 0.254: v54.5,48 55.5,48 55.5,46 63,46 64,45 71.5,45 72,45.5 v81.5,45.5
PD3  (1 unrouted)
PD4  (1 unrouted)
PD5  (1 unrouted)
  Top 0.254: 76.25,34.76 IC3.11
PD6  (1 unrouted)
PROM_DO  (via drill 0.6)
  Top 0.254: U1.P65 58.5,22.52 v58.5,25.5 | v62.75,23.25 63.25,22.75 70.75,22.75 72.41,21.09 IC1.1
  Bottom 0.254: v58.5,25.5 58.5,24.25 61.75,24.25 v62.75,23.25
PROM_INITB  (via drill 0.6)
  Top 0.254: U1.P58 54.97,24.22 55,24.25 54.75,24.5 v53.75,24.5 | IC1.8 74.96,16.54 73.75,17.75 v74,18
  Bottom 0.254: v53.75,24.5 54.75,24.5 55,24.25 55,21.5 63.5,21.5 63.5,19.5 72,19.5 73.5,18 v74,18
PS2CLK  (via drill 0.5)
  Top 0.254: v32,19 32,19.5 32.5,20 41.5,20 42.25,20.75 47.75,20.75 48.97,21.97 U1.P46
  Bottom 0.254: R47.2 31.75,11.75 32,12 v32,19 32,15 30.95,16.05 R4.1 T1.2
PS2DAT  (via drill 0.5)
  Top 0.254: U1.P44 48,23.02 48,22 47.25,21.25 41.75,21.25 41,20.5 27.5,20.5 27.25,20.25 v27.25,17.25
  Bottom 0.254: R51.2 23.52,14.32 T3.2 R6.1 | 25.95,16.05 25.94,16.06 R6.1 | R6.1 25.95,16.05 | v27.25,17.25 27.25,16.25 27,16 26,16 25.95,16.05
R0  (1 unrouted)
  Top 0.254: U1.P55 53.47,18.97 53,18.5
R1
  Top 0.254: U1.P53 52.47,20.47 50.25,18.25 49.25,18.25 48.5,17.5 48.5,16.55 R9.1
RESET  (1 unrouted)
SCART_BLANKING  (via drill 0.6)
  Top 0.254: v50.75,10.25 50.75,4.03 X1.16
  Bottom 0.254: R50.1 48,13 v50.75,10.25
SCART_BLUE
  Bottom 0.254: R33.1 R32.1 R31.1 68.45,9.66 X1.7
SCART_COMP  (1 unrouted)
  Bottom 0.254: 45.2,9.2 45,9 | X1.19 45.2,9.27 R13.1 R14.1
SCART_GREEN
  Bottom 0.254: X1.11 60.45,9.28 60.45,12.5 60.5,12.55 | R27.1 R28.1 60.5,12.55 | 60.5,12.55 R26.1
SCART_LEFT  (1 unrouted)
  Bottom 0.254: C3.2 75.5,9
SCART_RED
  Bottom 0.254: R16.1 R20.1 R15.1 52.7,9.15 X1.15
SCART_RIGHT
  Bottom 0.254: C4.2 79.25,9.13 X1.1
SD_CLK  (via drill 0.6)  (1 unrouted)
  Top 0.254: U1.P41 46.5,23.05 v46.5,25
  Bottom 0.254: v46.5,25 46,25 46,25.5 42,25.5 42,30.75 31.5,30.75 30.5,31.75 30,31.75
SD_CS  (via drill 0.6)
  Top 0.254: v25.75,47.25 25.75,46.25 46.5,46.25 46.5,44.45 U1.P140
  Bottom 0.254: v25.75,47.25 25.75,41.75 29,41.75 29.5,42.25 29.74,42.01 U$3.1
SD_DI  (via drill 0.6)
  Top 0.254: U1.P141 46,44.45 46,45.75 24.5,45.75 v24.5,46.25
  Bottom 0.254: v24.5,46.25 24.5,39.25 29.54,39.25 U$3.2
SD_DO  (via drill 0.6)
  Top 0.254: U1.P40 45.97,24.22 45.75,24.25 45.25,24.25 v45,24.5
  Bottom 0.254: v45,24.5 40.25,24.5 38,26.75 29.94,26.75 U$3.7
SPI_MISO  (via drill 0.6)  (1 unrouted)
  Top 0.254: IC3.17 84.98,36.02 v85,36
SPI_MOSI  (via drill 0.6)  (1 unrouted)
  Top 0.254: IC3.16 81.03,34.53 81.5,35 v83.5,35
  Bottom 0.254: v83.5,35 84.5,35
SPI_SCLK  (via drill 0.6)  (1 unrouted)
  Top 0.254: IC3.15 79.47,33.78 79.75,33.5 81,33.5 81.5,34 v82,34
SPI_SEL  (1 unrouted)
TCK  (via drill 0.6, 0.7)  (2 unrouted)
  Top 0.254: IC1.6 79.34,17.84 v79.75,18.25 | R2.2 62.75,50.75 v62.25,51.25 | IC3.19 82.88,37.62 v83.5,37
  Bottom 0.254: v79.75,18.25 79.75,30.25 | v62.25,51.25 62.25,47.75 63,47 64,47 65,46 70.5,46 71,46.5 79.5,46.5 80,47 83,47 83.5,46.5 v83.5,37
TDI_FPGA  (via drill 0.6)  (2 unrouted)
  Top 0.254: v79.25,39.25 81.75,39.25
  Bottom 0.254: R1.2 42.81,42.31 44.5,44 44.5,45 62,45 63,44 72.5,44 73,44.5 76.25,44.5 78.5,42.75 78.5,40 v79.25,39.25
TDO_EXP  (1 unrouted)
  Top 0.254: IC3.23 84.82,40.82 85,41
TDO_FPGA  (via drill 0.6)
  Top 0.254: U1.P109 61.97,43.47 61.5,43 v61.25,43 | IC1.4 74.14,19.14 v74,19.25
  Bottom 0.254: v61.25,43 62.75,41.5 62.75,40.25 64,39 64,20 74,20 v74,19.25
TDO_PROM  (via drill 0.7)  (2 unrouted)
  Top 0.254: IC1.17 81.86,19.14 v81,20
  Bottom 0.254: v81,20 80.5,20.5 80.5,31.25
TMS  (via drill 0.6, 0.7)  (2 unrouted)
  Top 0.254: IC1.5 78.49,18.49 78.75,18.75 v78.75,19.75 | R3.2 v60.75,52 | IC3.18 80.32,36.82 v80,36.5
  Bottom 0.254: v78.75,19.75 78.75,29.75 | v60.75,52 60.75,47.75 62,46.5 63.5,46.5 64.5,45.5 71,45.5 71.5,46 80,46 80.5,46.5 82.5,46.5 82.5,37.5 82,37 80,37 v80,36.5
VCC  (via drill 0.5, 0.6)  (17 unrouted)
  Top 0.2: U$6.P8 36.25,45 v36.5,44.75
  Top 0.254: IC1.19 IC1.20 | IC1.19 IC1.18 | 59,22.52 U1.P66 59,22.58 59,24.5 v59.75,25.5 59.75,26 v62.25,26 U1.P75 | U1.P19 v44,33.5 44.5,33 48.5,33 49,33.5 49.5,33.5 | U1.P3 v44,41.5 | U1.P138 47.47,42.28 v47.5,41.75 47.25,41.5 v44,41.5 | U1.P91 v62.25,34 | U1.P126 53.47,38.97 v54,38.5 | 44.25,41.75 v44,41.5 | v52.5,35 51,33.5 v52,32.5 | U1.P54 52.97,28.47 v53.5,29 | U1.P106 62,41.5 | U1.P43 47.47,25.72 | 47.47,25.75 47.47,25.72 | 47.47,25.72 v47.75,25.75 | U1.P34 44,26 v44,26.5 | v58.25,41.75 59,41.5 58.97,41.53 U1.P115 | v36.5,44.75 36,45 | Q5.3 44.1,12.4 44,12.5 | 42.1,12.4 v42,12.5 | 52.1,12.4 52,12.5 51.85,12.5 Q6.3 | 63.6,12.4 63.5,12.5 | 55.02,12.4 U$2.VDD | v23.5,19 23.5,19.5 25.5,19.5 25.5,21.5 | T2.3 13.25,47.75 13,47.5 | R22.1 16.25,47.75 16.5,47.5 | 23.25,47.5 23.25,47.75 | 30.57,49.93 30.5,50 | R55.1 v92.25,41.25 | v76,28.5 77.69,28.5 IC2.8 78,28.8 78,30 78.5,30.5 82,30.5 83,29.5 83,21.48 IC1.20 | 84.1,12.4 84.25,12.25 | C26.1 83.5,12 | IC1.19 85.44,20.44 85.5,20.38 | IC1.20 84.09,21.09 | v86,20 85.88,20 85.5,20.38 | 85.5,19 85.5,20.38 | R43.1 R42.1 30.5,53.55 | 51.95,53.55 52,53.5 | SV3.1 30.5,50.5 | IC3.31 74.87,43.12 74.75,43 74.75,43.03 IC3.32 74.53,43.25 v73.75,43.5 | IC3.4 76.22,39.22 76.5,39.5 76.5,40.75 v77,40.75
  Top 0.6: v44,41.5 44.5,41 44.5,40 46.5,40 46.5,36.5 49.5,33.5 | 49.5,33.5 49.5,32 46.5,29 46.5,26.25 | 49.5,33.5 51,33.5 v56.5,33.5 | v58.25,41.75 58.75,41.75 v58.75,33.5 58.75,32.25 59.75,30.5 v59.75,25.5 | 63,43.5 62.25,42.75 62.25,41.5 62,41.5 59,41.5 | 46.5,26.25 45.25,26.25 45,26 45,25.5 44,25.5 44,24.75 43.5,24 | 46.5,26.25 47.47,25.75 | U$4.4 12.6,28.15 12.9,28.15 13,28.25 13.5,28.25 13.5,28 10.25,28 9.5,28.75 | SV3.1 30.57,49.93
  Top 0.7: v44,41.5 44,43.25 42.5,43.25 42,43.75 42,45 36.25,45 | 36,45 23.25,45 23.25,47.5 16.5,47.5 13,47.5 | 23.25,47.75 25.5,50 30.5,50 | R40.1 R44.1 R41.1 R45.1 R42.1 51.95,53.55 | R46.2 R36.2 R39.2 R35.2 R38.2 R37.2 65.15,53.15 65,53 | 30.5,50.5 30.5,53.55 | 63,43.5 63,45.5 64.5,47 64.5,53.5
  Top 0.8: 36.25,45 36,45 | 13,47.5 9.5,47.5 9.5,28.75 | v25,30.25 25,27.75 | 13.5,26.75 13.5,25.75 16,23.25 18.4,23.25 C39.+ | 25.5,23.25 19,23.25 18.5,23.75 | Q6.3 Q5.3 42.1,12.4 | 52.1,12.4 55.02,12.4 Q8.3 63.4,12.4 63.5,12.5 | 65,12.4 Q7.3 69.6,12.4 70,12 83.5,12 84,12 84.25,12.25 85.5,13.5 85.5,19 85.57,19.07 | 65,12.4 63.6,12.4 | 65.28,12.43 65,12.4 | 25.5,21.5 25.5,16 25.71,15.79 SV5.3 37.46,15.79 37.5,15.75
  Top 0.813: 43.5,24 43.25,23.75 42,23.75 40,21.5 25.5,21.5 25.5,23.25 25.5,26.75 25,26.75 25,27.75 | 13.5,26.75 12.5,27.75
  Bottom 0.254: v44,41.5 45.5,41.5 45.25,41.25 C9.1 | v62.25,26 61,26 60.5,26.5 | v59.75,25.5 59,26.5 58.5,26.65 C8.1 59,26.65 C17.1 | v53.5,29 53,29.5 C15.1 52.1,32.4 v52,32.5 | v47.5,41.75 47.5,40.5 | 47.5,40.5 45.6,40.5 45.6,41.4 | v58.25,41.75 58.75,40.75 59,40.5 58.85,40.35 C7.1 C13.1 | v54,38.5 53.5,38.5 52.5,37.5 | v52.5,35 52.5,37.5 | v58.75,33.5 58.75,34 60.5,34 | 60.5,34 61,34 | 61,34 v62.25,34 | 60.9,34.1 61,34 | v47.75,25.75 C14.1 47.5,27 46.5,26 45.4,26 C16.1 45.1,26 44.5,26 v44,26.5 | C11.1 v44,33.5 | C10.1 60.5,34 | 52.5,37.5 C6.1 | C12.1 47.5,40.5 | v36.5,44.75 C34.1 | T3.3 25.71,17.99 R6.2 | 25.55,18.05 25.5,18 25.55,17.95 R6.2 | T1.3 29.01,17.46 R4.2 29,17.55 28.95,17.55 28.5,18 25.8,18 R6.2 | v23.5,19 23.5,18 | v92.25,41.25 90.5,41.25 90.25,41.5 | C29.1 75.75,28.25 v76,28.5 | v86,20 84.75,20 84.75,19.25 84.5,19 | v73.75,43.5 75,41.5 75.59,41.5 C27.1 76.06,41.5 76.25,41.5 v77,40.75 76.5,40.75
  Bottom 0.6: v56.5,33.5 v58.75,33.5
  Bottom 0.8: U$3.4 25,34.45 v25,30.25 | v42,12.5 38.71,15.79 SV5.4
VCC5  (via drill 0.5, 0.7)  (2 unrouted)
  Top 0.6: REG2.5.3 6.09,41.25 3,41.25
  Top 0.8: 3,25.5 3,33.25 3,41.25 3,43 3.5,43.5 v4,43.5 | 3,25.5 2.1,24.1 C33.+ 2.1,16.33 X7.2 | 17,19.5 17.5,19 17.5,16.5 | 17,19.5 14.5,22 10,22 6.5,25.5 3,25.5 | 17.5,16.5 v17.5,15.75 | 17.5,16.5 20,14 v25.25,14 26.3,14 27.5,12.8 27.5,9 28.33,8.17 SV5.9 SV5.10 | 17.09,19.59 17,19.5
  Top 0.813: REG1.2.3 3.56,33.19 3,33.25
  Bottom 0.8: v17.5,15.75 17.5,14.3 R7.2 17.5,14.2 17.5,11 15.1,8.6 X3.5 | v25.25,14 26.3,14 26.3,13.9 R5.2 | 3.9,43.41 v4,43.5
VCCAUX  (via drill 0.6)  (1 unrouted)
  Top 0.254: 50,24.5 v49.5,24.5 | U1.P62 57,22.58 57,25.5 | 57,25.5 57,31.5 | 57,31.5 57.5,31.5 | U1.P48 50,22.58 50,24.5 | 50,24.5 50,30.5 51,31.5 57,31.5 | v56,25.75 56.5,25.5 57,25.5 | U1.P134 49.47,43 | 49.47,43 49.47,42.78 v49.5,42.5 | U1.P120 56.47,43.03 | 49.47,43 49.97,42.5 50,42.5 50,36 | 56.47,43.03 56.47,42.97 57,42.5 57,36 57.5,36 | 56.47,43.03 v56.75,42.75
  Top 0.6: 57.5,31.5 57.5,36 50,36 49.5,36.5 v49,36.5
  Top 0.8: v33,34 23.75,34 23.5,34.25 23.5,39.25 22.4,40.35 C40.+ | REG2.5.4 12.6,42.15 14,40.75 18,40.75 18.5,40.25
  Bottom 0.254: v49.5,24.5 49.5,25.4 C21.1 50,25.65 50,21.5 49.5,21 40.19,21 SV5.2 47.67,18.33 48,18 R50.2 | C18.1 56,26.65 v56,25.75 | C19.1 49.5,41.85 v49.5,42.5 | 56.5,41.5 C20.1 v56.75,42.75
  Bottom 0.8: v49,36.5 44,36.5 44,35 34,35 v33,34
VCCINT  (via drill 0.5, 0.6)  (2 unrouted)
  Top 0.254: U1.P61 56.5,22.58 56.5,24.5 v56,24.5 55.5,24.5 54.5,25.5 54.5,30 50.5,30 50.5,24.5 | U1.P49 50.5,22.58 50.5,24.5 | 50.5,24.5 v51.25,24.5 | U1.P133 49.97,43.53 50.5,43 v51.5,43 | 55.5,43 56,43.5 56,44.5 | v23,26 23,32.75
  Top 0.8: v54.5,43 55.5,43 55.5,38 v54.5,37 | 54.5,30 v54.5,30.5 | v33,32.75 23,32.75 19,32.75 18.5,32.25 | REG1.2.4 12.6,34.65 15,32.25 18.1,32.25 C42.+
  Bottom 0.254: v56,24.5 55.5,24.5 54.75,25.25 | v51.25,24.5 52,24.5 52,25.75 | 54.75,25.25 C25.1 | 52,25.75 54.5,25.75 54.5,25.5 54.75,25.25 | 52,25.75 C24.1 | 54.25,42.75 v54.5,43 | SV5.1 34.98,18.52 33.5,20 25,20 23,22 v23,26
  Bottom 0.8: v54.5,43 v51.5,43 52,42.5 C22.1 | C23.1 54.25,42.75 | v54.5,30.5 54,30.5 54,33.75 | 54,33.75 54,37 v54.5,37 | 54,33.75 51.25,33.75 48.25,30.75 44,30.75 44,32 33.75,32 v33,32.75
W1  (via drill 0.6)
  Top 0.254: U1.P84 68.5,30.5 69,30 v69.5,30
  Bottom 0.254: v69.5,30 66,30 65,31
W2  (via drill 0.6)
  Top 0.254: U1.P85 70.25,31 70.75,30.5 v70.75,30
  Bottom 0.254: v70.75,30 70.75,30.25 70,31 66,31 65.5,31.5
W3  (via drill 0.6)
  Top 0.254: U1.P83 68,30 69,29 72,29 v72,29.5
  Bottom 0.254: v72,29.5 72,30.5 71,31.5 66.5,31.5 66,32
W4  (via drill 0.6)
  Top 0.254: U1.P82 67,29.5 68,28.5 73,28.5 73,29.75 v74,29.75
  Bottom 0.254: v74,29.75 73.75,29.75 71.5,32 67,32 66.5,32.5
W5  (via drill 0.6)
  Top 0.254: U1.P80 67,28.5 67.5,28 74,28 v74,28.5
  Bottom 0.254: v74,28.5 75,28.5 75,30.5 74.5,31 73.5,31 72,32.5 67.5,32.5 67,33
W6  (via drill 0.6)
  Top 0.254: U1.P79 66.5,28 67,27.5 75,27.5 75,29.75 v76,29.75
  Bottom 0.254: v76,29.75 76,30.5 75,31.5 74,31.5 72.5,33 68,33 67.5,33.5

## Text on the board
Bottom: CPCFPGA.COM rev 1 (c) 2012 Ranulf Doswell
tSilk: CPCFPGA.COM
_tsilk: 5V 0V